# Altium schematic sheet WX0.011.104DL.SchDoc: WX0.006.694DL
size A3; CompanyName: 浙江威星智能仪表股份有限公司; DocumentNumber: NB阀控水表; Revision: 1A; SheetNumber: 1; SheetTotal: 2; PageSetup: Record=PageOptions|CenterHorizontal=True|CenterVertical=True|PrintScale=1.04|XCorrection=1.00|YCorrection=1.00|PrintKind=0|BorderSize=5000000|LeftOffset=0|BottomOffset=0|Orientation=2|PaperLength=1000|PaperWidth=1000|Scale=100|PaperSource=7|PrintQuality=-3|MediaType=1|DitherType=10|PrintScaleMode=1|PaperKind=A3|PaperIndex=8
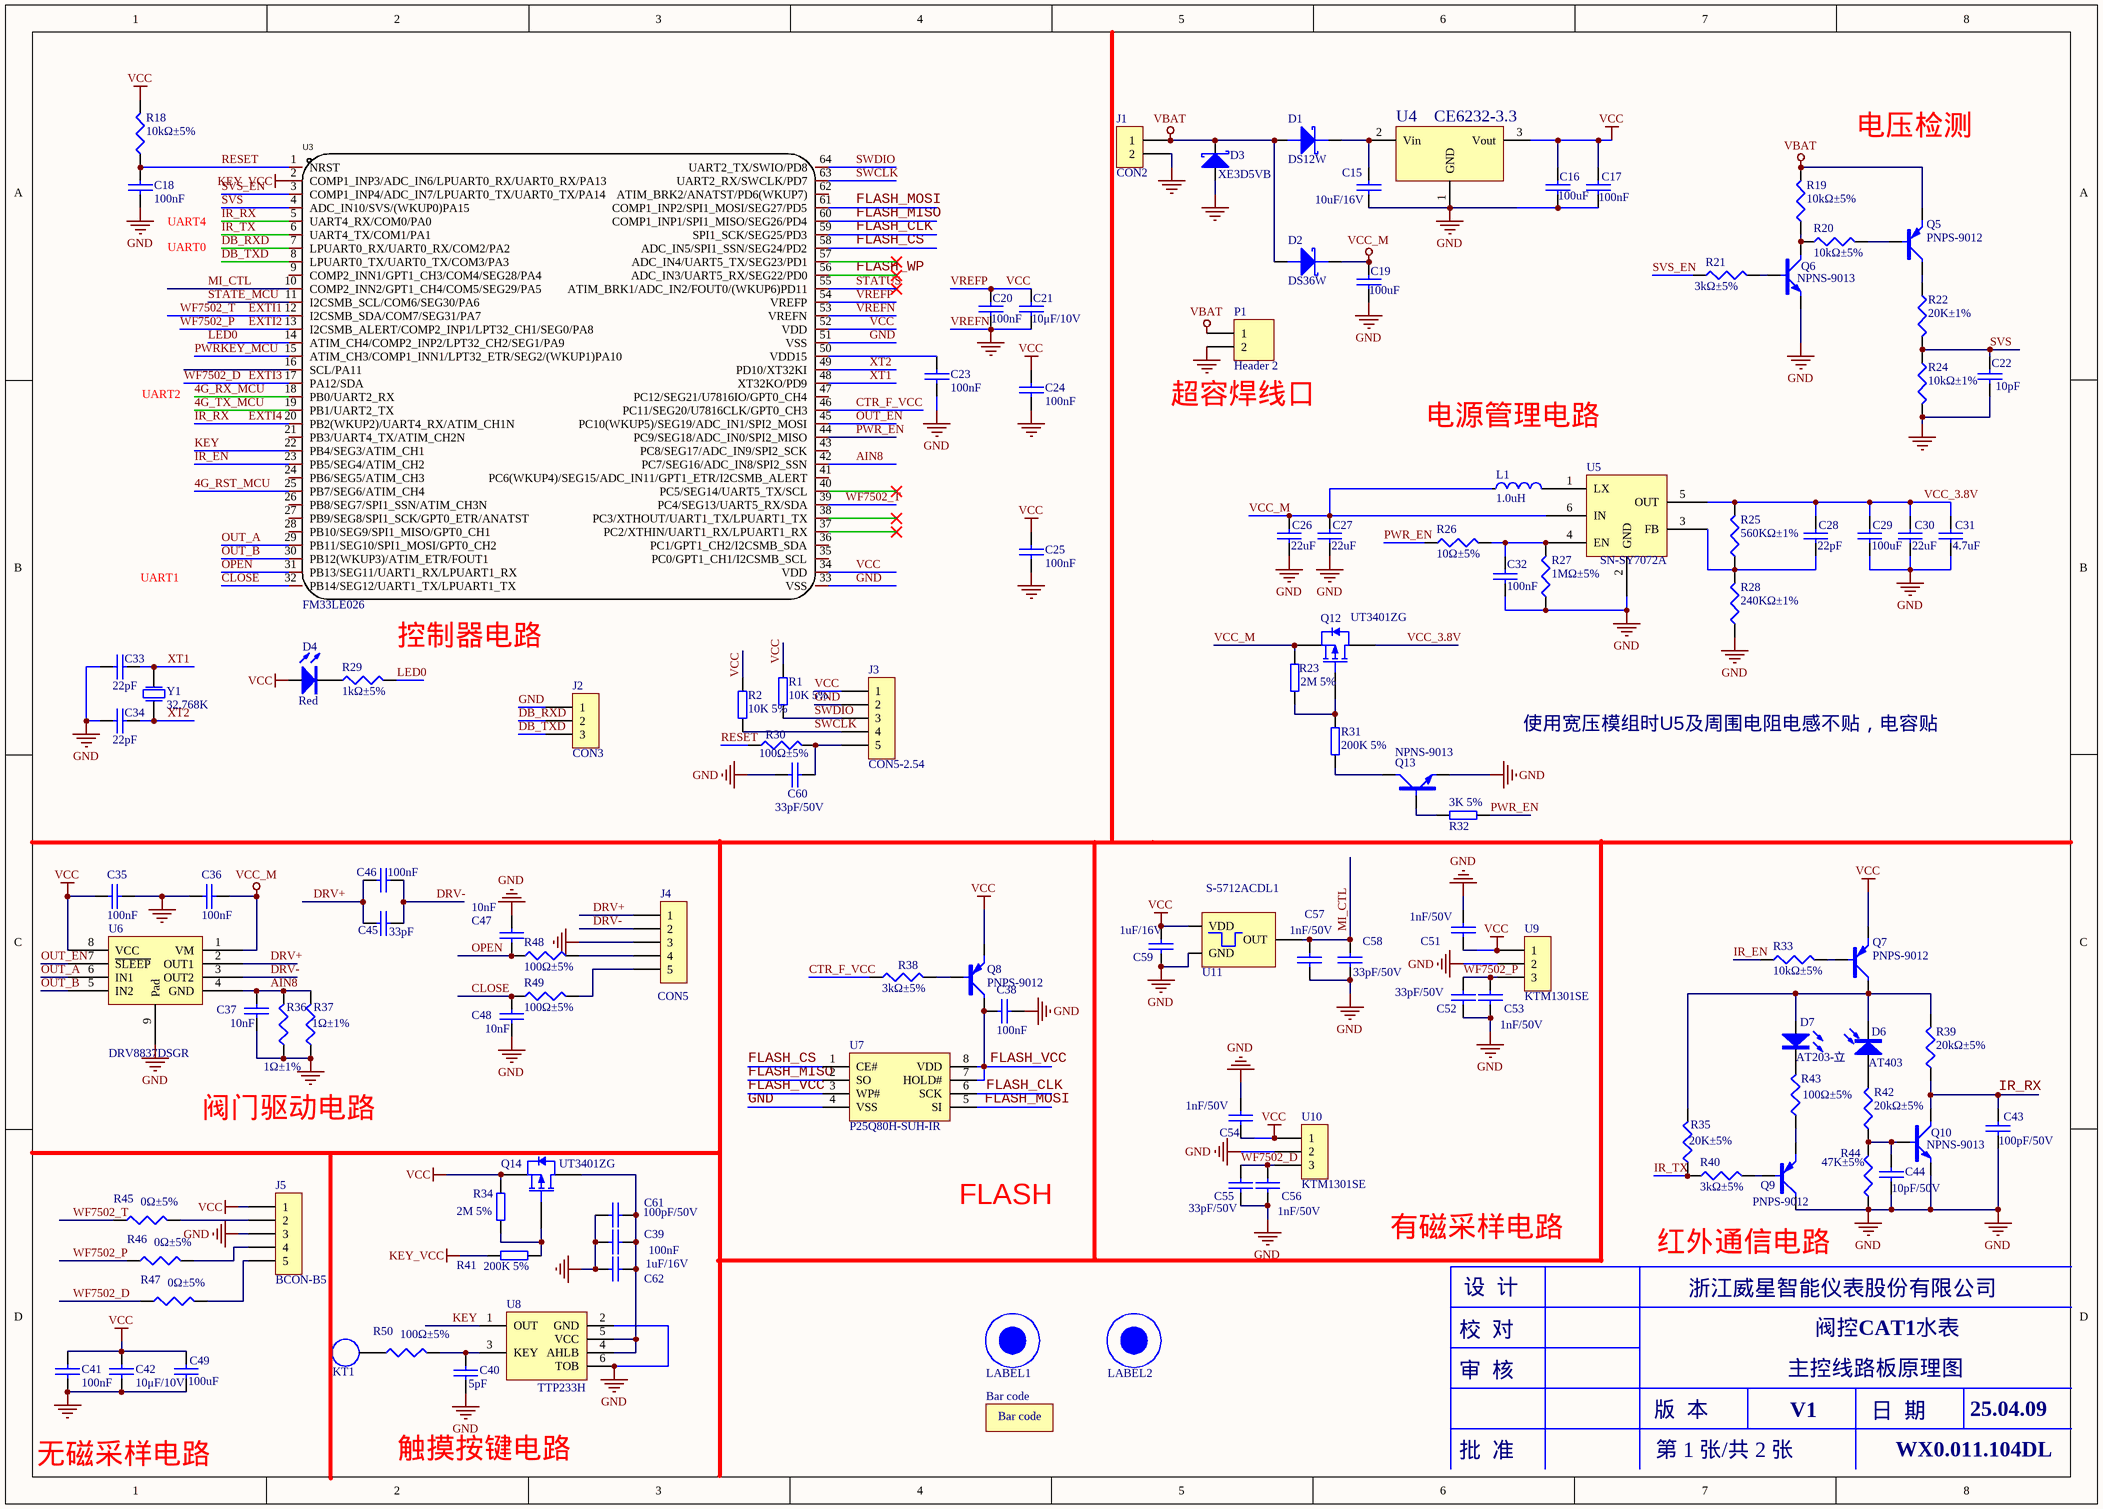
[diagram p0: WX0.011.104DL.SchDoc]

## Parts
Bar_code  Bar code  [Bar Code1]  (value not drawn)
C15  10uF/16V  [CAP0603]
C16  100uF  [GRM1206]
C17  100nF  [CAP0603]
C18  100nF  [CAP0603]
C19  100uF  [GRM1206]
C20  100nF  [CAP0603]
C21  10μF/10V  [CAP0603]
C22  10pF  [CAP0603]
C23  100nF  [CAP0603]
C24  100nF  [CAP0603]
C25  100nF  [CAP0603]
C26  22uF  [CAP0603]
C27  22uF  [CAP0603]
C28  22pF  [CAP0603]
C29  100uF  [GRM1206]
C30  22uF  [CAP0603]
C31  4.7uF  [CAP0603]
C32  100nF  [CAP0603]
C33  22pF  [CAP0603]
C34  22pF  [CAP0603]
C35  100nF  [CAP0603]
C36  100nF  [CAP0603]
C37  10nF  [CAP0603]
C38  100nF  [CAP0603]
C39  100nF  [CAP0603]
C40  5pF  [CAP0603]
C41  100nF  [CAP0603]
C42  10μF/10V  [CAP0603]
C43  100pF/50V  [CAP0603]
C44  10pF/50V  [CAP0603]
C45  33pF  [CAP0603]
C46  100nF  [CAP0603]
C47  10nF  [CAP0603]
C48  10nF  [CAP0603]
C49  100uF  [GRM1206]
C51  1nF/50V  [CAP0603]
C52  33pF/50V  [CAP0603]
C53  1nF/50V  [CAP0603]
C54  1nF/50V  [CAP0603]
C55  33pF/50V  [CAP0603]
C56  1nF/50V  [CAP0603]
C57  1nF/50V  [CAP0603]
C58  33pF/50V  [CAP0603]
C59  1uF/16V  [CAP0603]
C60  33pF/50V  [CAP0603]
C61  100pF/50V  [CAP0603]
C62  1uF/16V  [CAP0603]
D1  DS12W  [SOD-123FL]
D2  DS36W  [SOD-123FL]
D3  XE3D5VB  [SOD-323_L1.8-W1.3-LS2.5-RD]
D4  Red  [LED-0603]
D6  AT403  [LED2_300]
D7  AT203-立  [LED2_300]
J1  CON2  [SIP-2]  (no BOM)
J2  CON3  [SIP-3]  (no BOM)
J3  CON5-2.54  [PIN254_1*5*1100S]  (no BOM)
J4  CON5  [PIN254_1*5*1100S]  (no BOM)
J5  BCON-B5  [J_DIP_2.0_1*05_H]  (no BOM)
KT1  Touch  [TOUCH-1]  (value not drawn)
L1  1.0uH  [IND-SMD_L3.0-W3.0]
LABEL1  (no value)  [MARK]  (no BOM)
LABEL2  (no value)  [MARK]  (no BOM)
P1  Header 2  [SIP-2]
Q5  PNPS-9012  [SOT-23]
Q6  NPNS-9013  [SOT-23]
Q7  PNPS-9012  [SOT-23]
Q8  PNPS-9012  [SOT-23]
Q9  PNPS-9012  [SOT-23]
Q10  NPNS-9013  [SOT-23]
Q12  UT3401ZG  [SOT-23]
Q13  NPNS-9013  [SOT-23]
Q14  UT3401ZG  [SOT-23]
R1  10K 5%  [RES0603]
R2  10K 5%  [RES0603]
R18  10kΩ±5%  [RES0603]
R19  10kΩ±5%  [RES0603]
R20  10kΩ±5%  [RES0603]
R21  3kΩ±5%  [RES0603]
R22  20K±1%  [RES0603]
R23  2M 5%  [RES0603]
R24  10kΩ±1%  [RES0603]
R25  560KΩ±1%  [RES0603]
R26  10Ω±5%  [RES0603]
R27  1MΩ±5%  [RES0603]
R28  240KΩ±1%  [RES0603]
R29  1kΩ±5%  [RES0603]
R30  100Ω±5%  [RES0603]
R31  200K 5%  [RES0603]
R32  3K 5%  [RES0603]
R33  10kΩ±5%  [RES0603]
R34  2M 5%  [RES0603]
R35  20K±5%  [RES0603]
R36  1Ω±1%  [R1206]
R37  1Ω±1%  [R1206]
R38  3kΩ±5%  [RES0603]
R39  20kΩ±5%  [RES0603]
R40  3kΩ±5%  [RES0603]
R41  200K 5%  [RES0603]
R42  20kΩ±5%  [RES0603]
R43  100Ω±5%  [RES0603]
R44  47K±5%  [RES0603]
R45  0Ω±5%  [RES0603]
R46  0Ω±5%  [RES0603]
R47  0Ω±5%  [RES0603]
R48  100Ω±5%  [RES0603]
R49  100Ω±5%  [RES0603]
R50  100Ω±5%  [RES0603]
U3  FM33LE026  [LQFP-64_L10.0-W10.0-P0.50-LS12.0-BL]
U4  CE6232-3.3  [SOT-89]
U5  SN-SY7072A  [SOT-23-6]
U6  DRV8837DSGR  [S-PWSON-N8]
U7  P25Q80H-SUH-IR  [SOP-8L-200MIL]
U8  TTP233H  [SOT-23-6]
U9  KTM1301SE  [ESP3_QYSW_JSZ]  (no BOM)
U10  KTM1301SE  [ESP3_QYSW_JSZ]  (no BOM)
U11  S-5712ACDL1  [SOT-23]
Y1  32.768K  [SMD-3215_2P]

## Nets
GND: C15.2 C16.1 C17.1 C18.1 C19.1 C20.1 C21.1 C22.1 C23.1 C24.1 C25.1 C26.1 C27.1 C29.1 C30.1 C31.1 C32.1 C33.1 C34.1 C35.1 C36.2 C37.1 C38.1 C39.1 C40.1 C41.1 C42.1 C43.2 C44.2 C47.2 C48.1 C49.1 C51.1 C52.2 C53.2 C54.1 C55.2 C56.2 C57.2 C58.2 C59.2 C60.1 C61.1 C62.2 D3.1(A) J1.2 J2.1 J3.2 J4.3 J5.3 P1.2 Q6.2(E) Q9.3(C) Q10.2(E) Q13.2(E) R24.2 R27.1 R28.1 R36.1 R37.1 R44.1 U3.33(VSS) U3.51(VSS) U3.53(VREFN) U4.1(GND) U5.2(GND) U6.9(Pad) U7.4(VSS) U8.2(GND) U8.6(TOB) U9.2 U10.2 U11.3(GND)  [also labelled VREFN]
KEY_VCC: R41.2 U3.2(COMP1_INP3/ADC_IN6/LPUART0_RX/UART0_RX/PA13)
VBAT: D1.1 D2.1 D3.2(K) J1.1 P1.1 Q5.2(E) R19.2
VCC: C16.2 C17.2 C20.2 C21.2 C24.2 C25.2 C35.2 C41.2 C42.2 C49.2 C51.2 C54.2 C59.1 D4.1(A) J3.1 J5.1 Q7.2(E) Q8.2(E) Q14.2(S) R1.2 R2.2 R18.2 R34.2 U3.34(VDD) U3.52(VDD) U3.54(VREFP) U4.3(Vout) U6.8(VCC) U9.1 U10.1 U11.1(VDD)  [also labelled VREFP]
VCC_M: C19.2 C26.2 C27.2 C36.1 D2.2 L1.1 Q12.2(S) R23.2 U5.6(IN) U6.1(VM)
4G_RST_MCU: U3.25(PB7/SEG6/ATIM_CH4)
4G_RX_MCU: U3.18(PB0/UART2_RX)
4G_TX_MCU: U3.19(PB1/UART2_TX)
AIN8: C37.2 R36.2 R37.2 U3.42(PC7/SEG16/ADC_IN8/SPI2_SSN) U6.4(GND)
CLOSE: C48.2 R49.1 U3.32(PB14/SEG12/UART1_TX/LPUART1_TX)
CTR_F_VCC: R38.1 U3.46(PC11/SEG20/U7816CLK/GPT0_CH3)
DB_RXD: J2.2 U3.7(LPUART0_RX/UART0_RX/COM2/PA2)
DB_TXD: J2.3 U3.8(LPUART0_TX/UART0_TX/COM3/PA3)
DRV+: C45.2 C46.2 J4.1 U6.2(OUT1)
DRV-: C45.1 C46.1 J4.2 U6.3(OUT2)
EXTI1: R45.1 U3.12(I2CSMB_SDA/COM7/SEG31/PA7) U3.39(PC4/SEG13/UART5_RX/SDA)  [also labelled WF7502_T]
EXTI2: C52.1 C53.1 R46.1 U3.13(I2CSMB_ALERT/COMP2_INP1/LPT32_CH1/SEG0/PA8) U9.3  [also labelled WF7502_P]
EXTI3: C55.1 C56.1 R47.1 U3.17(PA12/SDA) U10.3  [also labelled WF7502_D]
EXTI4: C43.1 Q10.3(C) R39.1 U3.5(UART4_RX/COM0/PA0) U3.20(PB2(WKUP2)/UART4_RX/ATIM_CH1N)  [also labelled IR_RX]
FLASH_CLK: U3.59(SPI1_SCK/SEG25/PD3) U7.6(SCK)
FLASH_CS: U3.58(ADC_IN5/SPI1_SSN/SEG24/PD2) U7.1(CE#)
FLASH_MISO: U3.60(COMP1_INP1/SPI1_MISO/SEG26/PD4) U7.2(SO)
FLASH_MOSI: U3.61(COMP1_INP2/SPI1_MOSI/SEG27/PD5) U7.5(SI)
FLASH_VCC: C38.2 Q8.3(C) U7.3(WP#) U7.7(HOLD#) U7.8(VDD)
FLASH_WP: U3.56(ADC_IN3/UART5_RX/SEG22/PD0)
IR_EN: R33.1 U3.23(PB5/SEG4/ATIM_CH2)
IR_TX: R35.1 R40.1 U3.6(UART4_TX/COM1/PA1)
KEY: U3.22(PB4/SEG3/ATIM_CH1) U8.1(OUT)
LED0: R29.2 U3.14(ATIM_CH4/COMP2_INP2/LPT32_CH2/SEG1/PA9)
MI_CTL: C57.1 C58.1 U3.10(COMP2_INN2/GPT1_CH4/COM5/SEG29/PA5) U11.2(OUT)
OPEN: C47.1 R48.1 U3.31(PB13/SEG11/UART1_RX/LPUART1_RX)
OUT_A: U3.29(PB11/SEG10/SPI1_MOSI/GPT0_CH2) U6.6(IN1)
OUT_B: U3.30(PB12(WKUP3)/ATIM_ETR/FOUT1) U6.5(IN2)
OUT_EN: U3.45(PC10(WKUP5)/SEG19/ADC_IN1/SPI2_MOSI) U6.7(~{SLEEP})
PWR_EN: R26.1 R32.2 U3.44(PC9/SEG18/ADC_IN0/SPI2_MISO)
PWRKEY_MCU: U3.15(ATIM_CH3/COMP1_INN1/LPT32_ETR/SEG2/(WKUP1)PA10)
RESET: C18.2 R18.1 R30.1 U3.1(NRST)
STATE_MCU: U3.11(I2CSMB_SCL/COM6/SEG30/PA6)
STATUS: U3.55(ATIM_BRK1/ADC_IN2/FOUT0/(WKUP6)PD11)
SVS: C22.2 R22.2 R24.1 U3.4(ADC_IN10/SVS/(WKUP0)PA15)
SVS_EN: R21.1 U3.3(COMP1_INP4/ADC_IN7/LPUART0_TX/UART0_TX/PA14)
SWCLK: J3.4 R2.1 U3.63(UART2_RX/SWCLK/PD7)
SWDIO: J3.3 R1.1 U3.64(UART2_TX/SWIO/PD8)
VCC_3.8V: C28.2 C29.2 C30.2 C31.2 Q12.3(D) R25.2 U5.5(OUT)
XT1: C33.2 U3.48(XT32KO/PD9) Y1.2(P2)
XT2: C34.2 U3.49(PD10/XT32KI) Y1.1(P1)
NetC15_1: C15.1 D1.2 U4.2(Vin)
NetC23_2: C23.2 U3.50(VDD15)
NetC28_1: C28.1 R25.1 R28.2 U5.3(FB)
NetC32_2: C32.2 R26.2 R27.2 U5.4(EN)
NetC39_2: C39.2 C61.2 C62.1 Q14.3(D) U8.4(AHLB) U8.5(VCC)
NetC40_2: C40.2 R50.2 U8.3(KEY)
NetC44_1: C44.1 Q10.1(B) R42.1 R44.2
NetC60_2: C60.2 J3.5 R30.2
NetD4_2: D4.2(K) R29.1
NetD6_1: D6.1(A) R42.2
NetD6_2: D6.2(K) D7.1(A) Q7.3(C) R35.2 R39.2
NetD7_2: D7.2(K) R43.2
NetJ4_4: J4.4 R48.2
NetJ4_5: J4.5 R49.2
NetJ5_2: J5.2 R45.2
NetJ5_4: J5.4 R46.2
NetJ5_5: J5.5 R47.2
NetKT1_1: KT1.1 R50.1
NetL1_2: L1.2 U5.1(LX)
NetQ5_1: Q5.1(B) R20.2
NetQ5_3: Q5.3(C) R22.1
NetQ6_1: Q6.1(B) R21.2
NetQ6_3: Q6.3(C) R19.1 R20.1
NetQ7_1: Q7.1(B) R33.2
NetQ8_1: Q8.1(B) R38.2
NetQ9_1: Q9.1(B) R40.2
NetQ9_2: Q9.2(E) R43.1
NetQ12_1: Q12.1(G) R23.1 R31.2
NetQ13_1: Q13.1(B) R32.1
NetQ13_3: Q13.3(C) R31.1
NetQ14_1: Q14.1(G) R34.1 R41.1

Not connected (* = marked no-connect by the designer): U3 9(COMP2_INN1/GPT1_CH3/COM4/SEG28/PA4) 16(SCL/PA11) 21(PB3/UART4_TX/ATIM_CH2N) 24(PB6/SEG5/ATIM_CH3) 26(PB8/SEG7/SPI1_SSN/ATIM_CH3N) 27(PB9/SEG8/SPI1_SCK/GPT0_ETR/ANATST) 28(PB10/SEG9/SPI1_MISO/GPT0_CH1) 35(PC0/GPT1_CH1/I2CSMB_SCL) 36(PC1/GPT1_CH2/I2CSMB_SDA) 37(PC2/XTHIN/UART1_RX/LPUART1_RX)* 38(PC3/XTHOUT/UART1_TX/LPUART1_TX)* 40(PC5/SEG14/UART5_TX/SCL)* 41(PC6(WKUP4)/SEG15/ADC_IN11/GPT1_ETR/I2CSMB_ALERT) 43(PC8/SEG17/ADC_IN9/SPI2_SCK) 47(PC12/SEG21/U7816IO/GPT0_CH4) 57(ADC_IN4/UART5_TX/SEG23/PD1)* 62(ATIM_BRK2/ANATST/PD6(WKUP7))

## Notes on the sheet
- 电压检测
- (near C18) UART4
- UART0
- UART2
- (near P1) 超容焊线口
- 电源管理电路
- UART1
- 控制器电路
- 使用宽压模组时U5及周围电阻电感不贴，电容贴
- 阀门驱动电路
- FLASH
- 有磁采样电路
- 红外通信电路
- 设  计
- 浙江威星智能仪表股份有限公司
- 审  核
- 校  对
- 主控线路板原理图
- 阀控CAT1水表
- 触摸按键电路
- 批  准
- 版  本
- 第 1 张/共 2 张
- V1
- 日  期
- WX0.011.104DL
- 25.04.09
- 无磁采样电路
- 校 对
- 设 计
- 审 核
- PROJECT :
- 标准化
- 工 艺
- Size
- A3
- Docment Number
- Revision
- File
- Date
- Sheet
- of

## Library data of the parts
Bar_code = txm
C15 = 101020103-0003: 105pF,16V,±10%,0603,国巨,CC0603KRX7R7BB105; Part Name: 0603贴片电容; ID: 24; Address1: 国巨（YAGEO）; SMD/DIP: SMD; Part Number: 101020103-0003; ID1: 24
C16 C19 C29 C49 = 16: 贴片电容,100uF±20%/6.3V,X5R,村田; Part Number: 101020101-0020; Manufacturer P/N: GRM31CR60J107ME39L; ID: 16; Part Name: 贴片电容; Manufacturer: 村田
C17 C18 C20 C23-C25 C32 C35 C36 C38 C39 C41 C45 C46 = 1: 贴片电容,100nF±10%/50V,X7R,国巨; Part Number: 101020103-0021; Manufacturer P/N: CC0603KRX7R9BB104; ID: 1; Part Name: 贴片电容; Manufacturer: 国巨
C21 = 8: 贴片电容,10μF±10%/10V,X7R,村田; Part Number: 101020103-0026; Manufacturer P/N: GRM188R61A106KE47D; ID: 8; Part Name: 贴片电容; Manufacturer: 村田
C22 = 15: 贴片电容,12pF±5%/50V,NPO,国巨; Part Number: 101020103-0005; Manufacturer P/N: CC0603JRNPO9BN12; ID: 15; Part Name: 贴片电容; Manufacturer: 国巨
C26 C27 C30 = 19: 贴片电容,22uF±20%,10V,X5R,村田; Part Number: 101020103-0037; Manufacturer P/N: GRM188R61A226ME15D; ID: 19; Part Name: 贴片电容; Manufacturer: 村田
C28 C33 C34 = 3: 贴片电容,22pF±5%/50V,NP0,国巨; Part Number: 101020103-0009; Manufacturer P/N: CC0603JRNPO9BN22; ID: 3; Part Name: 贴片电容; Manufacturer: 国巨
C31 = 14: 贴片电容,4.7uF±10%/35V,X5R,村田; Part Number: 101020103-0036; Manufacturer P/N: GRM188R6YA475KE15D; ID: 14; Part Name: 贴片电容; Manufacturer: 村田
C37 C47 C48 = 5: 贴片电容,10nF±10%/50V,X7R,国巨; Part Number: 101020103-0007; Manufacturer P/N: CC0603KRX7R9BB103; ID: 5; Part Name: 贴片电容; Manufacturer: 国巨
C40 = 18: 贴片电容,4.7pF±0.25pF/50V,NPO,国巨; Part Number: 101020103-0040; Manufacturer P/N: CC0603CRNP09BN4R7; ID: 18; Part Name: 贴片电容; Manufacturer: 国巨
C42 = 2: 贴片电容,1μF±10%/16V,X7R,国巨; Part Number: 101020103-0003; Manufacturer P/N: CC0603KRX7R7BB105; ID: 2; Part Name: 贴片电容; Manufacturer: 国巨
C43 C61 = 101020103-0010: 101pf,50 V,±5%,0603,国巨,CC0603JRNP09BN101; Part Name: 0603贴片电容; ID: 4; SMD/DIP: SMD; Part Number: 101020103-0010
C44 = 101020103-0014: 10pF,50 V,±5%,0603,X7R,国巨,CC0603JRNPO9BN100; Part Name: 0603贴片电容; ID: 7; SMD/DIP: SMD; Part Number: 101020103-0014
C51 C53 C54 C56 C57 = 101020103-0022: 102pF,50 V,±10%,0603,国巨,CC0603KRX7R9BB102; Part Name: 0603贴片电容; ID: 13; SMD/DIP: SMD; Part Number: 101020103-0022
C52 C55 C58 C60 = 101020103-0027: 33pF,50 V,±10%,0603,国巨,CC0603KRNPO9BN33; Part Name: 0603贴片电容; ID: 17; SMD/DIP: SMD; Part Number: 101020103-0027
C59 C62 = 101020103-0003: 105pF,16 V,±10%,0603,国巨,CC0603KRX7R7BB105; Part Name: 0603贴片电容; ID: 14; SMD/DIP: SMD; Part Number: 101020103-0003
D1 D2 = 101040101-0055: DS36W,SOD123-FL,3 A,42 V,60 V,浙江领晨科技有限公司,DS36W; Part Name: 贴片肖特基; ID: 34; SMD/DIP: SMD; Part Number: 101040101-0055
D3 = 12: 具有3.5pF低结电容，适用于IO线、电源线、高速信号的ESD二极管阵列,SOD-323,5 V,5 V,350 W,5 A,1 uA,矽航,XE3D5VB; Part Number: 101040104-0010; Part Name: ESD管; ID: 12; Manufacturer: 矽航
D4 = 3: 发光二极管,红色,0603,光宝; Part Number: 101040102-0006; ID: 3; Part Name: 发光二极管; Manufacturer: 光宝
D6 = 6: 红外接收头，插件，红光，AT403_PD_01; Part Number: 101040102-0011; Part Name: 红外接收管; Manufacturer: 品观; ID: 6; SMD/DIP: DIP
D7 = 5: 红外发射头，插件，红光，AT203; Part Number: 101040102-0010; Part Name: 红外发射管; Manufacturer: 品观; ID: 5
J1 = 1: 焊接插座,间距2.54mm; ID: 1; Part Number: *; Part Name: 焊接插座
J2 = 2: 焊接插座,间距2.54mm; ID: 2; Part Number: *; Part Name: 焊接插座
J3 = 15: 焊接插座,间距2.0mm; Part Name: 焊接插件; ID: 15
J4 = 4: 焊接插座,间距2.54mm; ID: 4; Part Number: *; Part Name: 焊接插座
J5 = 14: 焊接插座,90度插板双面焊盘,公头,间距1.5mm; ID: 14; Part Name: 焊接插座
KT1 = 2: 按键,6mm弹簧按键,按键直径10mm; Part Number: 1011001-0060; ID: 2; Part Name: 按键
L1 = 9: 电感，1.0uH,2.7A,±20%,3.3*1.5mm，74438335010，伍尔特电子有限公司; Part Number: 1010302-0019; Part Name: 电感; ID: 9
LABEL1 LABEL2 = 1: 标准Mark点,直径1mm,阻焊开窗3mm; Part Name: 虚拟器件; ID: 1; Part Number: *
Q5 Q7-Q9 = 101040201-0001: 9012,PNP,SOT-23,JCET;长电,S9012; Part Name: 贴片三极管; ID: 16; SMD/DIP: SMD; Part Number: 101040201-0001
Q6 Q10 = 101040201-0002: 9013,NPN,SOT-23,长电,S9013; Part Name: 贴片三极管; ID: 14; SMD/DIP: SMD; Part Number: 101040201-0002
Q12 Q14 = 101040201-0013: UT3401ZG,P-MOS,SOT-23,UTC,UT3401ZG; Part Name: 功率MOS管; ID: 18; SMD/DIP: SMD; Part Number: 101040201-0013
Q13 = 101040201-0002: 9013,NPN,SOT-23,长电,S9013; Part Name: 贴片三极管; ID: 15; SMD/DIP: SMD; Part Number: 101040201-0002
R1 R2 = 101010103-0003: 国巨,±5%,0603,,155 ℃,-55 ℃,RC0603JR-0710KL,无铅,200 ppm/℃,1/10W,,10K; Part Name: 0603贴片电阻; ID: 7; SMD/DIP: SMD; Part Number: 101010103-0003
R18-R20 R38 = 2: 贴片电阻,10kΩ±5%,1/10W,100ppm/℃,国巨; Part Number: 101010103-0003; Manufacturer P/N: RC0603JR-0710KL; ID: 2; Part Name: 贴片电阻; Manufacturer: 国巨
R21 = 12: 贴片电阻,4.7kΩ±5%,1/10W,100ppm/℃,国巨; Part Number: 101010103-0042; Manufacturer P/N: RC0603JR-074K7L; ID: 12; Part Name: 贴片电阻; Manufacturer: 国巨
R22 = 23: 贴片电阻，20K,±1%,1/10W,0603,国巨,RC0603FR-0720KL; Part Number: 101010103-0048; Part Name: 贴片电阻; ID: 23; Manufacturer: 国巨; Manufacturer P/N: RC0603FR-0720KL
R23 R34 = 101010103-0025: 国巨,±5%,0603,,155 ℃,-55 ℃,RC0603JR-072ML,含铅,100 ppm/℃,1/10W,,2M; Part Name: 0603贴片电阻; ID: 20; SMD/DIP: SMD; Part Number: 101010103-0025
R24 = 6: 贴片电阻,10kΩ±1%,1/10W,100ppm/℃,国巨; Part Number: 101010103-0052; Manufacturer P/N: RC0603FR-0710KL; ID: 6; Part Name: 贴片电阻; Manufacturer: 国巨
R25 = 47: 贴片电阻，560KΩ±1%,0603,国巨，RC0603FR-07560KL; Part Number: 101010103-0109; Part Name: 贴片电阻; Manufacturer: 国巨; ID: 47; Manufacturer P/N: RC0603FR-07560KL
R26 = 11: 贴片电阻,10Ω±5%,1/10W,100ppm/℃,国巨; Part Number: 101010103-0017; Manufacturer P/N: RC0603JR-0710RL; ID: 11; Part Name: 贴片电阻; Manufacturer: 国巨
R27 R35 = 4: 贴片电阻,1MΩ±5%,1/10W,100ppm/℃,国巨; Part Number: 101010103-0002; Manufacturer P/N: RC0603JR-071ML; ID: 4; Part Name: 贴片电阻; Manufacturer: 国巨
R28 = 46: 贴片电阻，240KΩ±1%,0603,国巨，RC0603FR-07240KL; Part Number: 101010103-0105; Part Name: 贴片电阻; Manufacturer: 国巨; ID: 46; Manufacturer P/N: RC0603FR-07240KL
R29 R33 R40 = 1: 贴片电阻,1kΩ±5%,1/10W,100ppm/℃,国巨; Part Number: 101010103-0008; Manufacturer P/N: RC0603JR-071KL; ID: 1; Part Name: 贴片电阻; Manufacturer: 国巨
R30 = 15: 贴片电阻,0Ω±5%,1/10W,100ppm/℃,国巨; Part Number: 101010103-0001; Manufacturer P/N: RC0603JR-070RL; ID: 15; Part Name: 贴片电阻; Manufacturer: 国巨
R31 R41 = 101010103-0034: 200K,±5%,1/10W,0603,国巨,RC0603JR-07200KL; Part Name: 0603贴片电阻; ID: 13; SMD/DIP: SMD; Part Number: 101010103-0034
R32 = 101010103-0006: 国巨,±5%,0603,,155 ℃,-55 ℃,RC0603JR-073KL,无铅,100 ppm/℃,1/10W,,3K; Part Name: 0603贴片电阻; ID: 23; SMD/DIP: SMD; Part Number: 101010103-0006
R36 R37 = 41: 贴片电阻，1Ω±1%,1/4W,1206,国巨,RC1206FR-071RL; Part Number: 101010101-0034; Part Name: 贴片电阻; ID: 41; Manufacturer: 国巨; Manufacturer P/N: RC1206FR-071RL
R39 = 8: 贴片电阻,100kΩ±5%,1/10W,100ppm/℃,国巨; Part Number: 101010103-0005; Manufacturer P/N: RC0603FR-07100KL; ID: 8; Part Name: 贴片电阻; Manufacturer: 国巨
R42 = 7: 贴片电阻,20kΩ±5%,1/10W,100ppm/℃,国巨; Part Number: 101010103-0004; Manufacturer P/N: RC0603FR-0720KL; ID: 7; Part Name: 贴片电阻; Manufacturer: 国巨
R43 R45-R50 = 5: 贴片电阻,100Ω±5%,1/10W,100ppm/℃,国巨; Part Number: 101010103-0022; Manufacturer P/N: RC0603JR-07100RL; ID: 5; Part Name: 贴片电阻; Manufacturer: 国巨
R44 = 22: 贴片电阻，47K,±5%,1/10W,0603,国巨,RC0603JR-0747KL; Part Number: 101010103-0012; Part Name: 贴片电阻; ID: 22; Manufacturer: 国巨; Manufacturer P/N: RC0603JR-0747KL
U3 = 10: 单片机,FM33LE026,复旦微; Part Name: 集成电路; Symbol: FM33LC026N; Add into BOM: yes; CPU Core: CM0; Program Storage Size: 128KB; RAM Size: 24KB; GPIO Ports Number: 54; Operating Voltage Range: 1.8V~5.5V; CPU Maximum Speed: 64MHz; Program Memory Type: FLASH; ADC (Bit): 12bit; 16Bit Timer: 3; 32Bit Timer: 2; UART/USART: 6; I2C: 1; Internal Comparator: ��; Peripheral/Function: Ƭ���¶ȴ����������Ź����͵�ѹ��⣻Ӳ�������㷨���棻PWM��CCP����/�Ƚϣ�LCD/LED���������������������RTCʵʱʱ��; ID: 10; Device: FM33LC026N; Supplier: LCSC; Supplier Part: C648829; Manufacturer: 复旦微; Manufacturer Part: FM33LC026N; JLCPCB Part Class: Extended Part; LCSC Part Name: LC0ϵ�е͹���; Supplier Footprint: LQFP-64(10x10); Datasheet: https://atta.szlcsc.com/upload/public/pdf/source/20200616/C648829_514A77D3BF4E1F83D99F50A2DA443E89.pdf; Convert to PCB: yes; Operating Temperature Range: -40��~+85��; DAC (Bit): -; PWM (Bit): -; SPI: 2; Universal Serial Bus: -; communication protocol: -; Watchdog: ��; Real-Time Clock: ��; Infrared Data Association: -; Low-Voltage Detect: ��; CCP Capture/Compare: ��; Secure Digital Input and Output: -; Direct Memory Access: -; Internal Oscillator: ��
U4 = 1010503-0029: CE6232-3.3,CE6232-3.3,SOT89-3,8V,1.8V,0.11V,3.3V,300mA,0.8uA,南京芯力微电子有限公司; Part Name: 线性稳压芯片; ID: 10; SMD/DIP: SMD; ID1: 9; Part Number: 1010503-0029; Address1: 南京芯力微电子
U5 = 19: 集成电路，矽力杰股份有限公司，SN-SY7072A; Part Number: 1010503-0023; Part Name: 集成电路; ID: 19; SMD/DIP: SMD; Manufacturer: 矽力杰股份有限公司; Manufacturer P/N: SN-SY7072A
U6 = 101050101-0060: DRV8837DSGR,S-PWSON-N8,TI,DRV8837DSGR; Part Name: 阀门驱动芯片; ID: 25; Address1: TI（德州仪器）; SMD/DIP: SMD; ID1: 24; Part Number: 101050101-0060
U7 = 101050101-0218: P25Q80H-SUH-IR,SOP8 208mil,普冉半导体（上海）股份有限公司,P25Q80H-SUH-IR; Part Name: FLASH芯片; ID: 19; SMD/DIP: SMD; ID1: 18; Part Number: 101050101-0218; Address1: 普冉半导体（上海）股份有限公司
U8 = 5: 集成电路，TTP233H,TONTEK; Part Number: 101050101-0262; Part Name: 集成电路; Manufacturer P/N: TTP233H-HA6; ID: 5; Manufacturer: TONTEK
U9 U10 = 30: 昆泰KTM1301SE（插件）; Part Name: 接插件/连接器; ID: 30
U11 = 1010504-0002: S-5712ACDL1,SOT23-3,3.5 V,1.6 V,2 uA,精工电子,S-5712ACDL1; Part Name: 霍尔元件; ID: 2; SMD/DIP: SMD; Part Number: 1010504-0002
Y1 = 2: 晶振,32.768KHz,±20ppm,12.5pF,3215,EPSON; Part Number: 1010601-0009; ID: 2; Part Name: 晶振; Manufacturer: EPSON